# EAGLE design Anouchka (EAGLE 7.1.0)
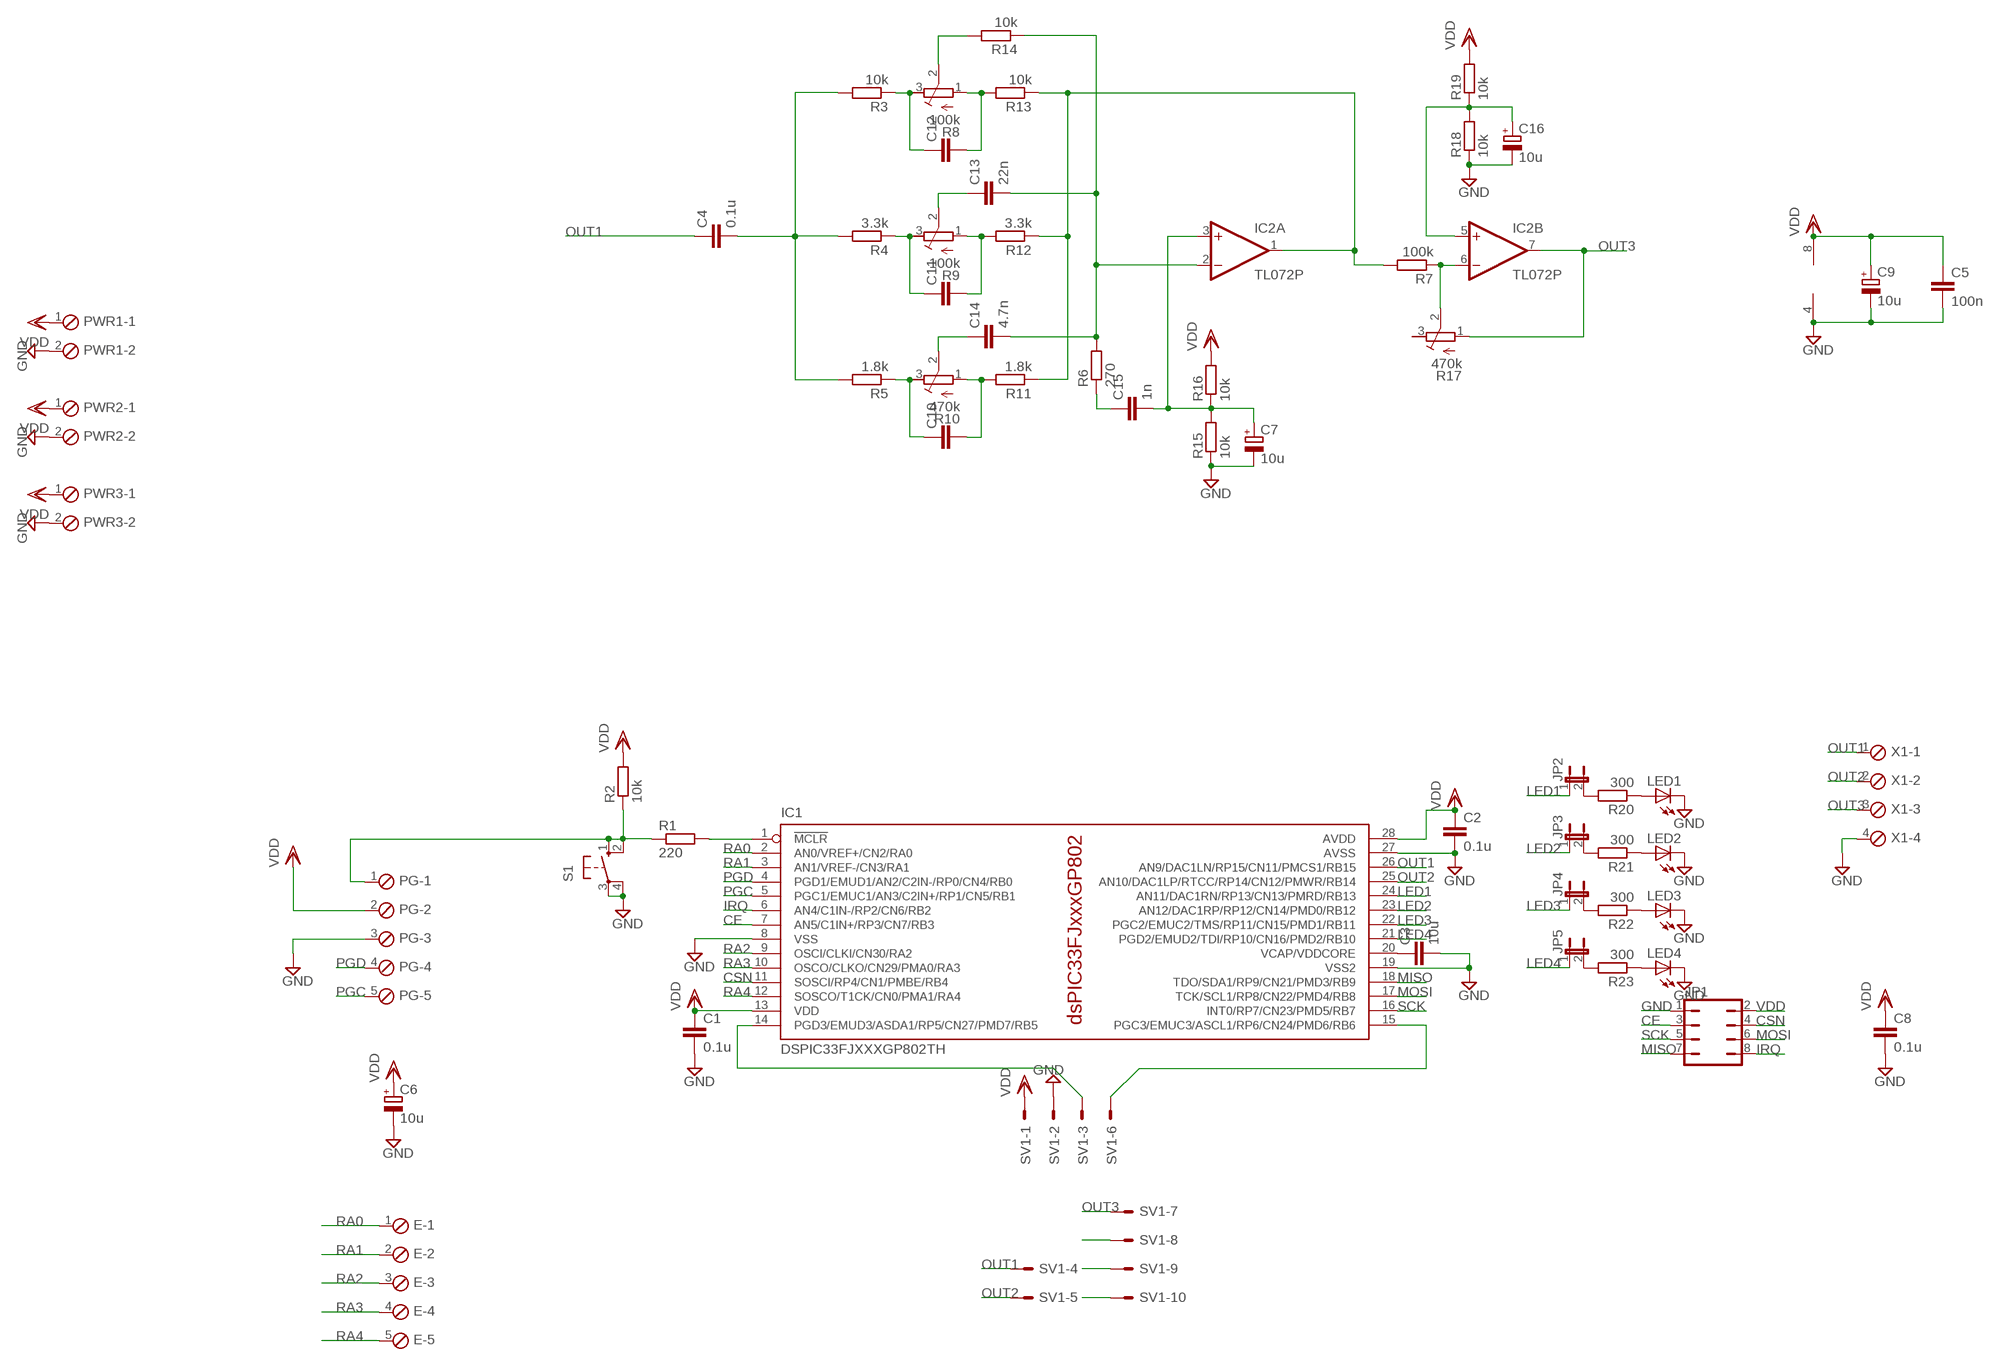
[diagram p0: schematic, sheet 1]

## Parts
C1  0.1u  C-EU025-024X044  [C025-024X044]
C2  0.1u  C-EU025-024X044  [C025-024X044]
C3  10u  C-EU025-024X044  [C025-024X044]
C4  0.1u  C-EU025-024X044  [C025-024X044]
C5  100n  C-EU025-024X044  [C025-024X044]
C6  10u  CPOL-EUE2.5-5  [E2,5-5]
C7  10u  CPOL-EUE2.5-5  [E2,5-5]
C8  0.1u  C-EU025-024X044  [C025-024X044]
C9  10u  CPOL-EUE2.5-5  [E2,5-5]
C10  C-EU025-024X044  [C025-024X044]
C11  C-EU025-024X044  [C025-024X044]
C12  C-EU025-024X044  [C025-024X044]
C13  22n  C-EU025-024X044  [C025-024X044]
C14  4.7n  C-EU025-024X044  [C025-024X044]
C15  1n  C-EU025-024X044  [C025-024X044]
C16  10u  CPOL-EUE2.5-5  [E2,5-5]
E  MPT5  [5POL254]
IC1  DSPIC33FJXXXGP802TH  [DIL28-3]
IC2  TL072P  [DIL08]
JP1  JP4Q  [JP4Q]
JP2  JP1E  [JP1]
JP3  JP1E  [JP1]
JP4  JP1E  [JP1]
JP5  JP1E  [JP1]
LED1  LED3MM  [LED3MM]
LED2  LED3MM  [LED3MM]
LED3  LED3MM  [LED3MM]
LED4  LED3MM  [LED3MM]
PG  MPT5  [5POL254]
PWR1  MPT2  [2POL254]
PWR2  MPT2  [2POL254]
PWR3  MPT2  [2POL254]
R1  220  R-EU_0207/10  [0207/10]
R2  10k  R-EU_0207/10  [0207/10]
R3  10k  R-EU_0207/10  [0207/10]
R4  3.3k  R-EU_0207/10  [0207/10]
R5  1.8k  R-EU_0207/10  [0207/10]
R6  270  R-EU_0207/10  [0207/10]
R7  100k  R-EU_0207/10  [0207/10]
R8  100k  R-TRIMM3339P  [RTRIM3339P]
R9  100k  R-TRIMM3339P  [RTRIM3339P]
R10  470k  R-TRIMM3339P  [RTRIM3339P]
R11  1.8k  R-EU_0207/10  [0207/10]
R12  3.3k  R-EU_0207/10  [0207/10]
R13  10k  R-EU_0207/10  [0207/10]
R14  10k  R-EU_0207/10  [0207/10]
R15  10k  R-EU_0207/10  [0207/10]
R16  10k  R-EU_0207/10  [0207/10]
R17  470k  R-TRIMM3339P  [RTRIM3339P]
R18  10k  R-EU_0207/10  [0207/10]
R19  10k  R-EU_0207/10  [0207/10]
R20  300  R-EU_0207/10  [0207/10]
R21  300  R-EU_0207/10  [0207/10]
R22  300  R-EU_0207/10  [0207/10]
R23  300  R-EU_0207/10  [0207/10]
S1  10-XX  [B3F-10XX]
SV1  ML10E  [ML10]
X1  MPT4  [4POL254]

## Nets
CE: IC1.7(AN5/C1IN+/RP3/CN7/RB3) JP1.3
CSN: IC1.11(SOSCI/RP4/CN1/PMBE/RB4) JP1.4
GND: C1.2 C2.2 C3.2 C5.2 C6.- C7.- C8.2 C9.- C16.- IC1.8(VSS) IC1.19(VSS2) IC1.27(AVSS) IC2.4(P:V-) JP1.1 LED1.K(C) LED2.K(C) LED3.K(C) LED4.K(C) PG.3 PWR1.2 PWR2.2 PWR3.2 R15.1 R18.1 S1.3(P) S1.4(P1) SV1.2 X1.4
IRQ: IC1.6(AN4/C1IN-/RP2/CN6/RB2) JP1.8
LED1: IC1.24(AN11/DAC1RN/RP13/CN13/PMRD/RB13) JP2.1
LED2: IC1.23(AN12/DAC1RP/RP12/CN14/PMD0/RB12) JP3.1
LED3: IC1.22(PGC2/EMUC2/TMS/RP11/CN15/PMD1/RB11) JP4.1
LED4: IC1.21(PGD2/EMUD2/TDI/RP10/CN16/PMD2/RB10) JP5.1
MISO: IC1.18(TDO/SDA1/RP9/CN21/PMD3/RB9) JP1.7
MOSI: IC1.17(TCK/SCL1/RP8/CN22/PMD4/RB8) JP1.6
N$1: IC1.1(!MCLR) R1.2
N$2: PG.1 R1.1 R2.1 S1.1(S) S1.2(S1)
N$3: C3.1 IC1.20(VCAP/VDDCORE)
N$4: IC2.1(A:OUT) R7.2 R11.1 R12.1 R13.1
N$5: C4.2 R3.2 R4.2 R5.2
N$6: C12.1 R3.1 R8.3(E)
N$7: C12.2 R8.1(A) R13.2
N$8: C11.1 R4.1 R9.3(E)
N$9: C11.2 R9.1(A) R12.2
N$10: C10.1 R5.1 R10.3(E)
N$11: C10.2 R10.1(A) R11.2
N$12: C14.1 R10.2(S)
N$13: C13.1 R9.2(S)
N$14: R8.2(S) R14.2
N$15: C13.2 C14.2 IC2.2(A:-IN) R6.2 R14.1
N$16: C15.1 R6.1
N$17: IC2.6(B:-IN) R7.1 R17.2(S)
N$18: C7.+ C15.2 IC2.3(A:+IN) R15.2 R16.1
N$20: C16.+ IC2.5(B:+IN) R18.2 R19.1
N$21: IC1.15(PGC3/EMUC3/ASCL1/RP6/CN24/PMD6/RB6) SV1.6
N$22: IC1.14(PGD3/EMUD3/ASDA1/RP5/CN27/PMD7/RB5) SV1.3
N$23: JP2.2 R20.2
N$26: SV1.8
N$27: SV1.9
N$28: JP3.2 R21.2
N$29: JP4.2 R22.2
N$30: JP5.2 R23.2
N$31: LED1.A R20.1
N$32: LED2.A R21.1
N$33: LED3.A R22.1
N$34: LED4.A R23.1
N$35: SV1.10
OUT1: C4.1 IC1.26(AN9/DAC1LN/RP15/CN11/PMCS1/RB15) SV1.4 X1.1
OUT2: IC1.25(AN10/DAC1LP/RTCC/RP14/CN12/PMWR/RB14) SV1.5 X1.2
OUT3: IC2.7(B:OUT) R17.1(A) SV1.7 X1.3
PGC: IC1.5(PGC1/EMUC1/AN3/C2IN+/RP1/CN5/RB1) PG.5
PGD: IC1.4(PGD1/EMUD1/AN2/C2IN-/RP0/CN4/RB0) PG.4
RA0: E.1 IC1.2(AN0/VREF+/CN2/RA0)
RA1: E.2 IC1.3(AN1/VREF-/CN3/RA1)
RA2: E.3 IC1.9(OSCI/CLKI/CN30/RA2)
RA3: E.4 IC1.10(OSCO/CLKO/CN29/PMA0/RA3)
RA4: E.5 IC1.12(SOSCO/T1CK/CN0/PMA1/RA4)
SCK: IC1.16(INT0/RP7/CN23/PMD5/RB7) JP1.5
VDD: C1.1 C2.1 C5.1 C6.+ C8.1 C9.+ IC1.13(VDD) IC1.28(AVDD) IC2.8(P:V+) JP1.2 PG.2 PWR1.1 PWR2.1 PWR3.1 R2.2 R16.2 R19.2 SV1.1
Unconnected: R17.3(E)

## Library data of the parts
C1-C5 C8 C10-C15 = rcl:C-EU: CAPACITOR, European symbol
C6 C7 C9 C16 = rcl:CPOL-EU: POLARIZED CAPACITOR, European symbol
E PG = con-phoenix-254:MPT5: PHOENIX CONNECTOR; OC_FARNELL: unknown; OC_NEWARK: unknown
IC1 = microchip-dspic33:DSPIC33FJXXXGP802: High-Performance, 16-bit Digital Signal Controllers - dsPIC33FJ64GP802 & dsPIC33FJ128GP802 Source: http://ww1.microchip.com/downloads/en/DeviceDoc/70292B.pdf Operating Range: . Up to 40 MIPS operation (at 3.0-3.6V): - Industrial temperature range (-40°C to +85°C) - Extended temperature range (-40°C to +125°C) High-Performance DSC CPU: . Modified Harvard architecture . C compiler optimized instruction set . 16-bit wide data path . 24-bit wide instructions . Linear program memory addressing up to 4M instruction words . Linear data memory addressing up to 64 Kbytes . 83 base instructions: mostly 1 word/1 cycle . Two 40-bit accumulators with rounding and saturation options . Flexible and powerful addressing modes: - Indirect - Modulo - Bit-Reversed . Software stack . 16 x 16 fractional/integer multiply operations . 32/16 and 16/16 divide operations . Single-cycle multiply and accumulate: - Accumulator write back for DSP operations - Dual data fetch . Up to ±16-bit shifts for up to 40-bit data On-Chip Flash and SRAM: . Flash program memory . Data SRAM . Boot, Secure, and General Security for program Flash Direct Memory Access (DMA): . 8-channel hardware DMA . Up to 2 Kbytes dual ported DMA buffer area (DMA RAM) to store data transferred via DMA: - Allows data transfer between RAM and a peripheral while CPU is executing code (no cycle stealing) . Most peripherals support DMA Timers/Capture/Compare/PWM: . Timer/Counters, up to five 16-bit timers: - Can pair up to make two 32-bit timers - One timer runs as a Real-Time Clock with an external 32.768 kHz oscillator - Programmable prescaler . Input Capture (up to four channels): - Capture on up, down or both edges - 16-bit capture input functions - 4-deep FIFO on each capture . Output Compare (up to four channels): - Single or Dual 16-bit Compare mode - 16-bit Glitchless PWM mode . Hardware Real-Time Clock/Calendar (RTCC): - Provides clock, calendar, and alarm functions Interrupt Controller: . 5-cycle latency . 118 interrupt vectors . Up to 49 available interrupt sources . Up to three external interrupts . Seven programmable priority levels . Five processor exceptions Digital I/O: . Peripheral pin Select functionality . Up to 35 programmable digital I/O pins . Wake-up/Interrupt-on-Change for up to 21 pins . Output pins can drive from 3.0V to 3.6V . Up to 5V output with open drain configuration . All digital input pins are 5V tolerant . 4 mA sink on all I/O pins System Management: . Flexible clock options: - External, crystal, resonator, internal RC - Fully integrated Phase-Locked Loop (PLL) - Extremely low jitter PLL . Power-up Timer . Oscillator Start-up Timer/Stabilizer . Watchdog Timer with its own RC oscillator . Fail-Safe Clock Monitor . Reset by multiple sources Power Management: . On-chip 2.5V voltage regulator . Switch between clock sources in real time . Idle, Sleep, and Doze modes with fast wake-up Analog-to-Digital Converters (ADCs): . 10-bit, 1.1 Msps or 12-bit, 500 Ksps conversion: - Two and four simultaneous samples (10-bit ADC) - Up to 13 input channels with auto-scanning - Conversion start can be manual or synchronized with one of four trigger sources - Conversion possible in Sleep mode - ±2 LSb max integral nonlinearity - ±1 LSb max differential nonlinearity Audio Digital-to-Analog Converter (DAC): . 16-bit Dual Channel DAC module . 100 Ksps maximum sampling rate . Second-Order Digital Delta-Sigma Modulator Data Converter Interface (DCI) module: . Codec interface . Supports I2S and AC.97 protocols . Up to 16-bit data words, up to 16 words per frame . 4-word deep TX and RX buffers Comparator Module: . Two analog comparators with programmable input/output configuration CMOS Flash Technology: . Low-power, high-speed Flash technology . Fully static design . 3.3V (±10%) operating voltage . Industrial and Extended temperature . Low power consumption Communication Modules: . 4-wire SPI (up to two modules): - Framing supports I/O interface to simple codecs - Supports 8-bit and 16-bit data - Supports all serial clock formats and sampling modes . I2C?: - Full Multi-Master Slave mode support - 7-bit and 10-bit addressing - Bus collision detection and arbitration - Integrated signal conditioning - Slave address masking . UART (up to two modules): - Interrupt on address bit detect - Interrupt on UART error - Wake-up on Start bit from Sleep mode - 4-character TX and RX FIFO buffers - LIN bus support - IrDA® encoding and decoding in hardware - High-Speed Baud mode - Hardware Flow Control with CTS and RTS . Enhanced CAN (ECAN. module) 2.0B active: - Up to eight transmit and up to 32 receive buffers - 16 receive filters and three masks - Loopback, Listen Only and Listen All - Messages modes for diagnostics and bus monitoring - Wake-up on CAN message - Automatic processing of Remote Transmission Requests - FIFO mode using DMA - DeviceNet. addressing support . Parallel Master Slave Port (PMP/EPSP): - Supports 8-bit or 16-bit data - Supports 16 address lines . Programmable Cyclic Redundancy Check (CRC): - Programmable bit length for the CRC generator polynomial (up to 16-bit length) - 8-deep, 16-bit or 16-deep, 8-bit FIFO for data input
IC2 = linear:TL072: OP AMP
JP1 = jumper:JP4Q: JUMPER
JP2-JP5 = jumper:JP1E: JUMPER
LED1-LED4 = led:LED: LED OSRAM: - CHIPLED LG R971, LG N971, LY N971, LG Q971, LY Q971, LO R971, LY R971 LH N974, LH R974 LS Q976, LO Q976, LY Q976 LO Q996 - Hyper CHIPLED LW Q18S LB Q993, LB Q99A, LB R99A - SideLED LS A670, LO A670, LY A670, LG A670, LP A670 LB A673, LV A673, LT A673, LW A673 LH A674 LY A675 LS A676, LA A676, LO A676, LY A676, LW A676 LS A679, LY A679, LG A679 - Hyper Micro SIDELED® LS Y876, LA Y876, LO Y876, LY Y876 LT Y87S - SmartLED LW L88C, LW L88S LB L89C, LB L89S, LG L890 LS L89K, LO L89K, LY L89K LS L896, LA L896, LO L896, LY L896 - TOPLED LS T670, LO T670, LY T670, LG T670, LP T670 LSG T670, LSP T670, LSY T670, LOP T670, LYG T670 LG T671, LOG T671, LSG T671 LB T673, LV T673, LT T673, LW T673 LH T674 LS T676, LA T676, LO T676, LY T676, LB T676, LH T676, LSB T676, LW T676 LB T67C, LV T67C, LT T67C, LS T67K, LO T67K, LY T67K, LW E67C LS E67B, LA E67B, LO E67B, LY E67B, LB E67C, LV E67C, LT E67C LW T67C LS T679, LY T679, LG T679 LS T770, LO T770, LY T770, LG T770, LP T770 LB T773, LV T773, LT T773, LW T773 LH T774 LS E675, LA E675, LY E675, LS T675 LS T776, LA T776, LO T776, LY T776, LB T776 LHGB T686 LT T68C, LB T68C - Hyper Mini TOPLED® LB M676 - Mini TOPLED Santana® LG M470 LS M47K, LO M47K, LY M47K Source: http://www.osram.convergy.de LUXEON: - LUMILED® LXK2-PW12-R00, LXK2-PW12-S00, LXK2-PW14-U00, LXK2-PW14-V00 LXK2-PM12-R00, LXK2-PM12-S00, LXK2-PM14-U00 LXK2-PE12-Q00, LXK2-PE12-R00, LXK2-PE12-S00, LXK2-PE14-T00, LXK2-PE14-U00 LXK2-PB12-K00, LXK2-PB12-L00, LXK2-PB12-M00, LXK2-PB14-N00, LXK2-PB14-P00, LXK2-PB14-Q00 LXK2-PR12-L00, LXK2-PR12-M00, LXK2-PR14-Q00, LXK2-PR14-R00 LXK2-PD12-Q00, LXK2-PD12-R00, LXK2-PD12-S00 LXK2-PH12-R00, LXK2-PH12-S00 LXK2-PL12-P00, LXK2-PL12-Q00, LXK2-PL12-R00 Source: www.luxeon.com KINGBRIGHT: KA-3528ASYC Source: www.kingbright.com
PWR1-PWR3 = con-phoenix-254:MPT2: PHOENIX CONNECTOR; OC_FARNELL: unknown; OC_NEWARK: unknown
R1-R7 R11-R16 R18-R23 = rcl:R-EU_: RESISTOR, European symbol
R8-R10 R17 = rcl:R-TRIMM: Trimm resistor
S1 = switch-omron:10-XX: OMRON SWITCH; MPN: B3F-1000; OC_FARNELL: 176432; OC_NEWARK: 36M3542
SV1 = con-ml:ML10E: HARTING; OC_FARNELL: unknown; OC_NEWARK: unknown
X1 = con-phoenix-254:MPT4: PHOENIX CONNECTOR; OC_FARNELL: unknown; OC_NEWARK: unknown

## Board
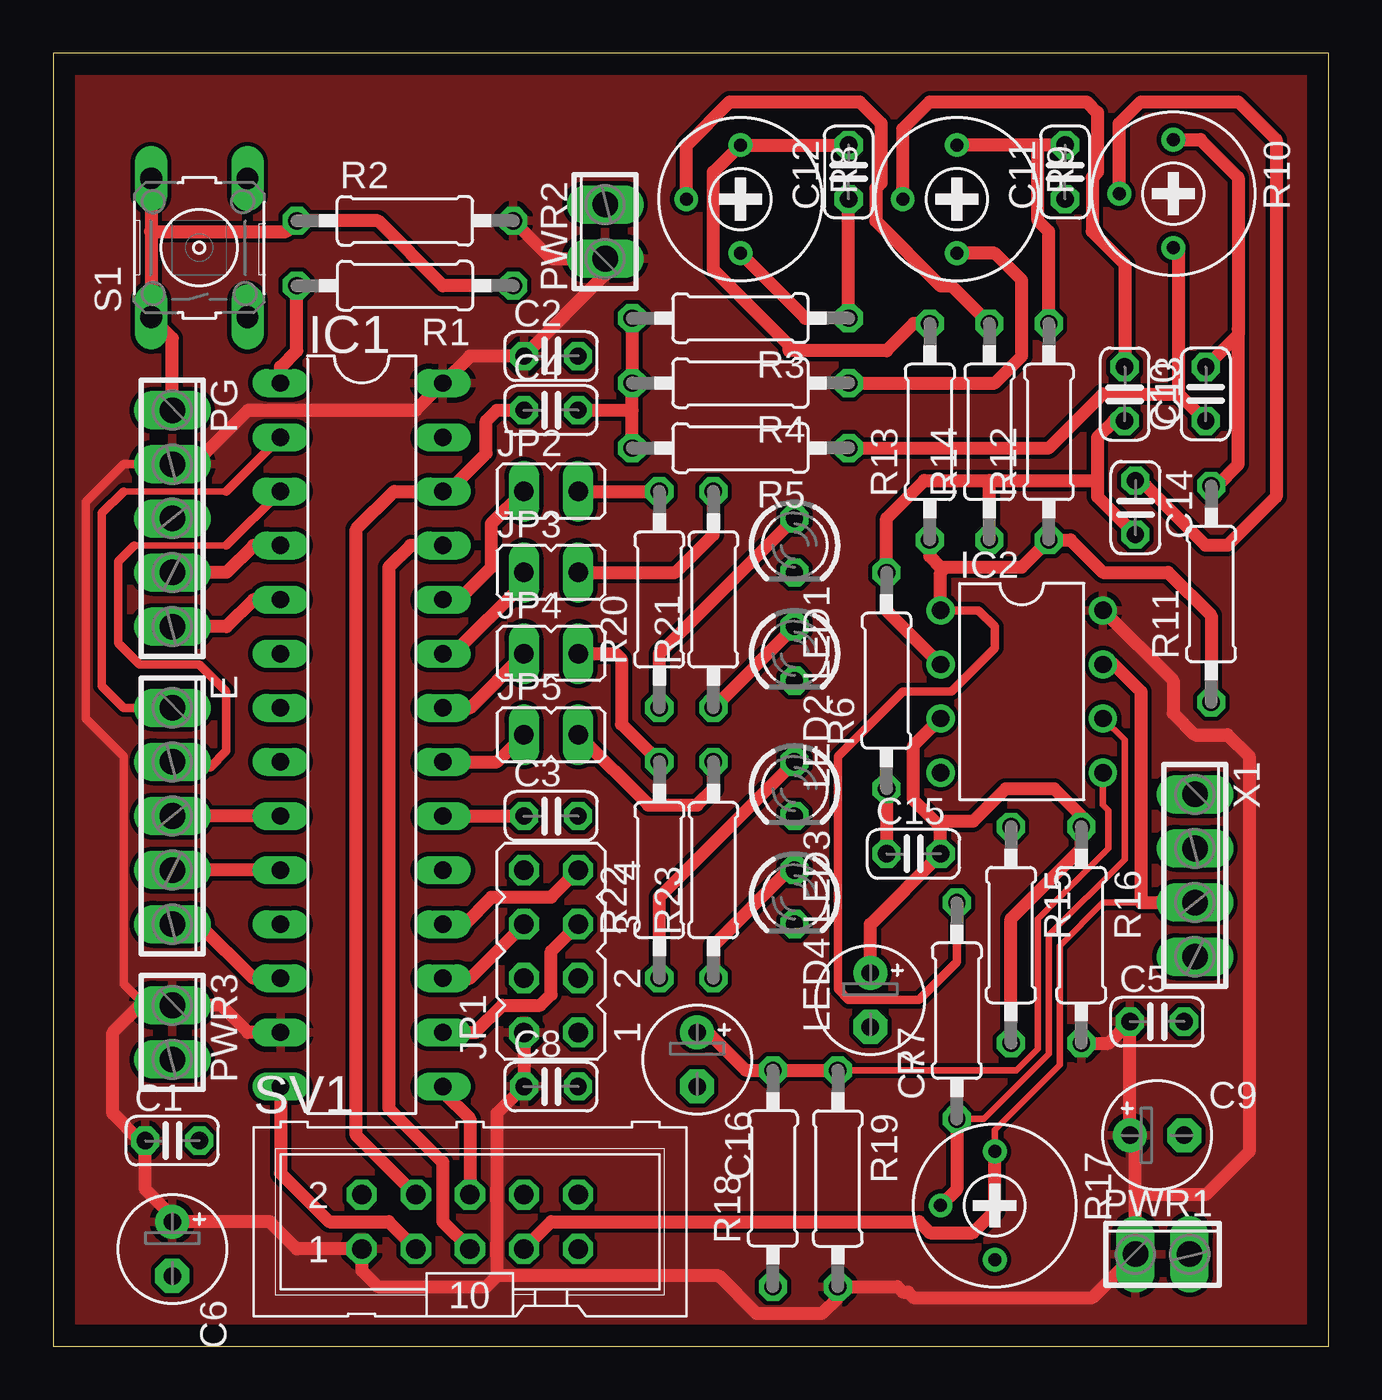
[diagram p1: board, top side]
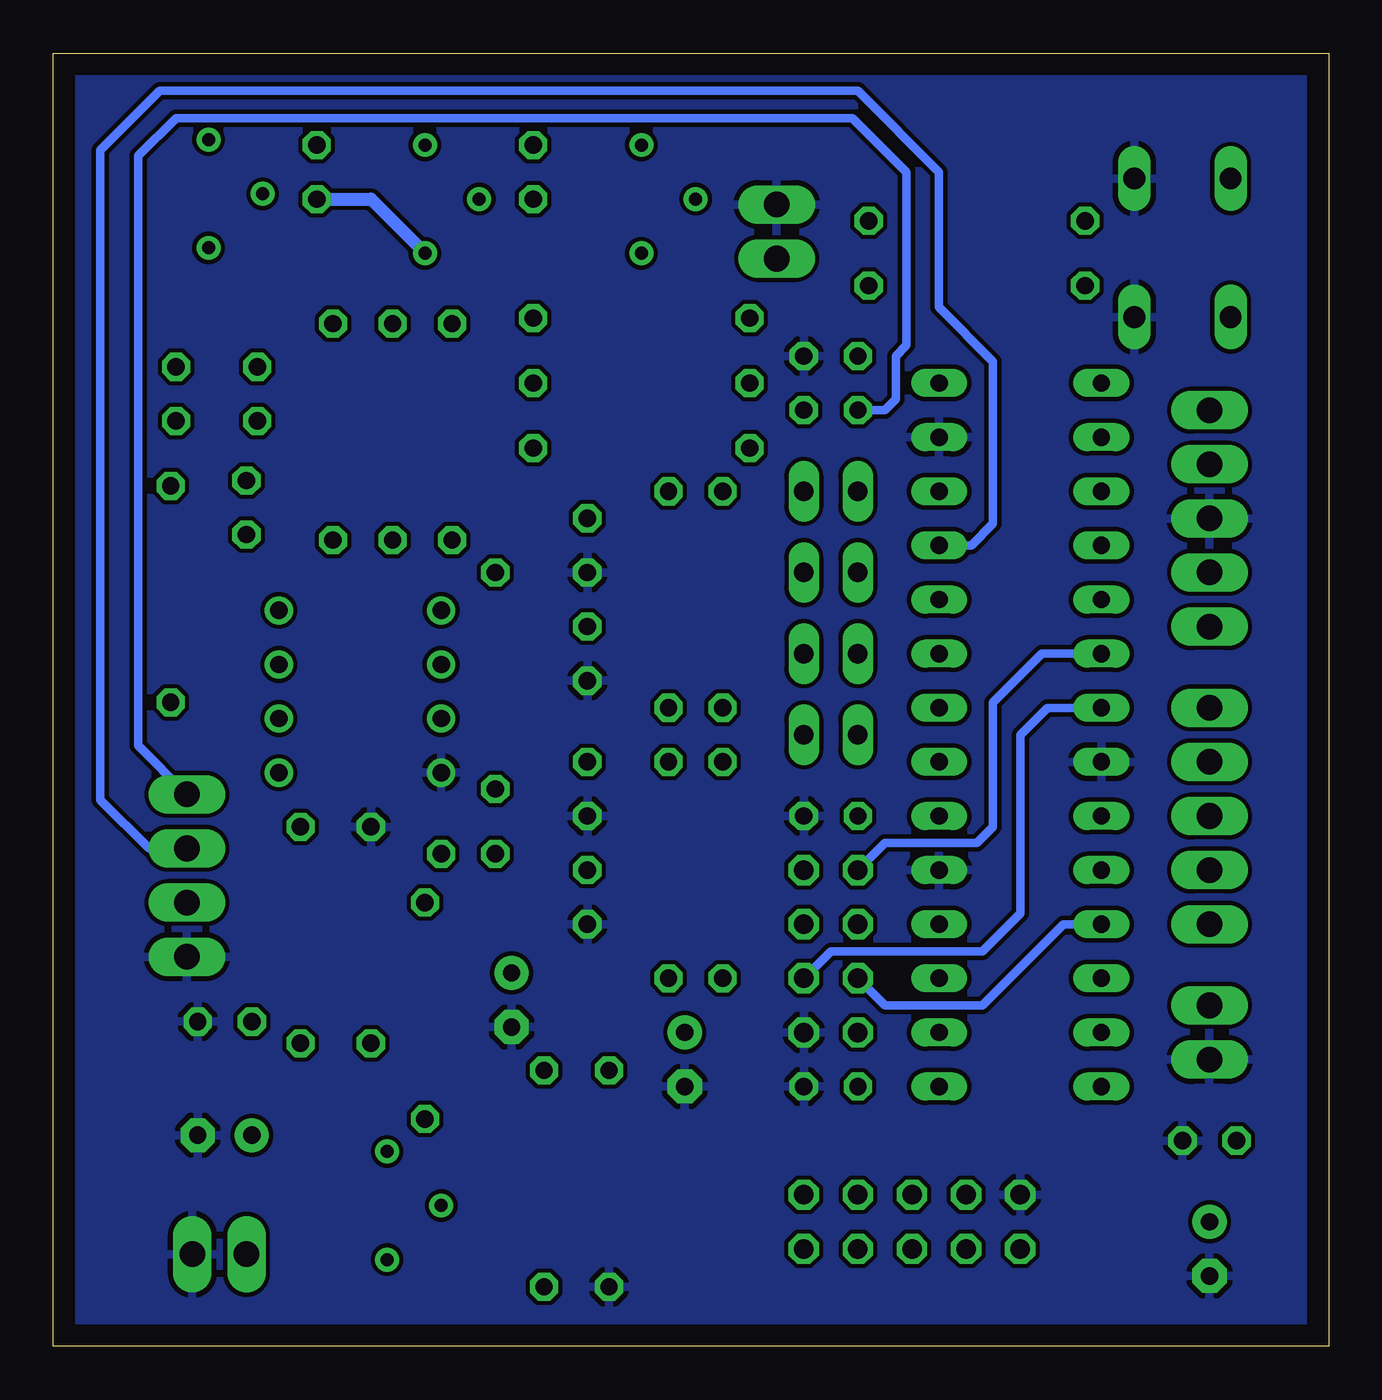
[diagram p2: board, bottom side, seen from below]

Size 59.87 x 60.7 mm. Coordinates in mm from the lower left corner, seen from the top.
Outline: 0,0 59.87,0 59.87,60.7 0,60.7 0,0
Copper layers (1*16): Top 0.035mm / dielectric 1.5mm / Bottom 0.035mm
Design rules "default": minimum track width 10mil, minimum drill 24mil, track to track 8mil, track to pad 8mil, pad to pad 8mil, via to via 8mil, smd to smd 8mil, copper to edge 40mil, drill to drill 8mil, minimum pad ring 10mil, minimum via ring 8mil, stop-mask expansion 4mil, vias tented up to drill 0mil, thermal gap 10mil

### Footprints (pad centres in the part's own frame; a part is rotated, then mirrored left to right if it is on the bottom)
C025-024X044 = drill 0.813 octagon: 1 -1.27,0; 2 1.27,0
E2,5-5 = drill 0.813 pad 1.6: + -1.27,0 | drill 0.813 pad 1.6 octagon: - 1.27,0
5POL254 = drill 1.2 long: 1 -5.08,0; 2 -2.54,0; 3 0,0; 4 2.54,0; 5 5.08,0
DIL28-3 = drill 0.813 long: 1 -16.51,-3.81; 2 -13.97,-3.81; 3 -11.43,-3.81; 4 -8.89,-3.81; 5 -6.35,-3.81; 6 -3.81,-3.81; 7 -1.27,-3.81; 8 1.27,-3.81; 9 3.81,-3.81; 10 6.35,-3.81; 11 8.89,-3.81; 12 11.43,-3.81; 13 13.97,-3.81; 14 16.51,-3.81; 15 16.51,3.81; 16 13.97,3.81; 17 11.43,3.81; 18 8.89,3.81; 19 6.35,3.81; 20 3.81,3.81; 21 1.27,3.81; 22 -1.27,3.81; 23 -3.81,3.81; 24 -6.35,3.81; 25 -8.89,3.81; 26 -11.43,3.81; 27 -13.97,3.81; 28 -16.51,3.81
DIL08 = drill 0.813 pad 1.27: 1 -3.81,-3.81; 2 -1.27,-3.81; 3 1.27,-3.81; 4 3.81,-3.81; 5 3.81,3.81; 6 1.27,3.81; 7 -1.27,3.81; 8 -3.81,3.81
JP4Q = drill 0.914 octagon: 1 -3.81,-1.27; 2 -3.81,1.27; 3 -1.27,-1.27; 4 -1.27,1.27; 5 1.27,-1.27; 6 1.27,1.27; 7 3.81,-1.27; 8 3.81,1.27
JP1 = drill 0.914 long: 1 0,-1.27; 2 0,1.27
LED3MM = drill 0.813 octagon: A -1.27,0; K 1.27,0
2POL254 = drill 1.2 long: 1 -1.27,0; 2 1.27,0
0207/10 = drill 0.813 octagon: 1 -5.08,0; 2 5.08,0
RTRIM3339P = drill 0.61: 1 -2.54,0; 2 0,-2.54; 3 2.54,0
B3F-10XX = drill 1.016 long: 1 -3.251,2.261; 2 3.251,2.261; 3 -3.251,-2.261; 4 3.251,-2.261
ML10 = drill 0.914 octagon: 1 -5.08,-1.27; 2 -5.08,1.27; 3 -2.54,-1.27; 4 -2.54,1.27; 5 0,-1.27; 6 0,1.27; 7 2.54,-1.27; 8 2.54,1.27; 9 5.08,-1.27; 10 5.08,1.27
4POL254 = drill 1.2 long: 1 -3.81,0; 2 -1.27,0; 3 1.27,0; 4 3.81,0

### Placement (x,y rotation side)
C1  5.59,9.65 0 top
C2  23.37,46.48 0 top
C3  23.37,24.89 0 top
C4  23.37,43.94 0 top
C5  51.82,15.24 0 top
C6  5.59,4.57 270 top
C7  38.35,16.26 270 top
C8  23.37,12.19 0 top
C9  51.82,9.91 0 top
C10  54.1,44.7 90 top
C11  47.5,55.12 90 top
C12  37.34,55.12 90 top
C13  50.29,44.7 270 top
C14  50.8,39.37 270 top
C15  40.39,23.11 0 top
C16  30.23,13.46 270 top
E  5.59,24.89 270 top
IC1  14.48,28.7 270 top
IC2  45.47,30.73 270 top
JP1  23.37,18.54 90 top
JP2  23.37,40.13 270 top
JP3  23.37,36.32 270 top
JP4  23.37,32.51 270 top
JP5  23.37,28.7 270 top
LED1  34.8,37.59 270 top
LED2  34.8,32.51 270 top
LED3  34.8,26.16 270 top
LED4  34.8,21.08 270 top
PG  5.59,38.86 270 top
PWR1  52.07,4.32 0 top
PWR2  25.91,52.32 90 top
PWR3  5.59,14.73 270 top
R1  16.51,49.78 180 top
R2  16.51,52.83 0 top
R3  32.26,48.26 180 top
R4  32.26,45.21 180 top
R5  32.26,42.16 180 top
R6  39.12,31.24 90 top
R7  42.42,15.75 90 top
R8  32.26,53.85 270 top
R9  42.42,53.85 270 top
R10  52.58,54.1 270 top
R11  54.36,35.31 90 top
R12  46.74,42.93 90 top
R13  41.15,42.93 90 top
R14  43.94,42.93 90 top
R15  44.96,19.3 270 top
R16  48.26,19.3 270 top
R17  44.2,6.6 270 top
R18  33.78,7.87 90 top
R19  36.83,7.87 270 top
R20  28.45,35.05 90 top
R21  30.99,35.05 90 top
R22  28.45,22.35 90 top
R23  30.99,22.35 90 top
S1  6.86,51.56 90 top
SV1  19.56,5.84 0 top
X1  53.59,22.1 270 top

### Tracks (layer width: path | path; a pad name or v marks a point on that pad's centre or on a via)
CE
  Bottom 0.406: IC1.7 13.21,29.97 14.48,28.7 14.48,20.32 16.26,18.54 23.37,18.54 JP1.3
CSN
  Bottom 0.406: IC1.11 12.45,19.81 16.26,16 20.83,16 JP1.4
GND
  pour Bottom: -5.33,80.52 99.57,80.77 94.23,-2.29 -4.83,-2.29
IRQ
  Bottom 0.406: IC1.6 13.46,32.51 15.75,30.23 15.75,24.38 16.51,23.62 20.83,23.62 JP1.8
LED1
  Top 0.61: IC1.24 19.05,35.05 20.57,36.58 20.57,38.61 JP2.1
LED2
  Top 0.61: IC1.23 18.8,32.51 22.1,35.81 JP3.1
LED3
  Top 0.61: IC1.22 19.56,29.97 JP4.1
LED4
  Top 0.61: IC1.21 20.83,27.43 JP5.1
MISO
  Top 0.61: IC1.18 19.3,19.81 20.57,21.08 23.37,21.08 JP1.7
MOSI
  Top 0.61: IC1.17 19.56,17.27 JP1.6
N$1
  Top 0.61: IC1.1 10.67,45.97 11.43,46.74 R1.2
N$2
  Top 0.61: PG.1 5.59,47.32 S1.1 S1.2 4.6,52.35 4.57,52.32 10.92,52.32 R2.1 15.24,52.83 18.29,49.78 R1.1
N$3
  Top 0.61: IC1.20 C3.1
N$4
  Top 0.406: R7.2 42.42,18.03 40.64,16.26 37.34,16.26 36.83,16.76 36.83,27.69 39.88,30.73 42.16,30.73 44.2,32.77 44.2,33.78 43.43,34.54 IC2.1
  Top 0.61: R13.1 41.15,37.08 41.66,36.58 41.91,36.58 | 41.91,36.58 45.47,36.58 R12.1 47.75,37.85 49.28,36.32 52.32,36.32 54.36,34.29 R11.1 | IC2.1 41.66,36.32 41.91,36.58
N$5
  Top 0.61: C4.2 27.18,43.94 | 27.18,43.94 R4.2 R3.2 | R5.2 27.18,43.94
N$6
  Top 0.61: R8.3 35.31,48.26 R3.1 C12.1
N$7
  Top 0.61: C12.2 R8.1 30.99,55.12 30.99,50.55 34.54,46.99 34.54,46.74 39.12,46.74 40.39,48.01 R13.2
N$8
  Top 0.61: R4.1 44.2,45.21 45.47,46.48 45.47,50.04 44.2,51.31 R9.3
  Bottom 0.61: C11.1 44.96,53.85 R9.3
N$9
  Top 0.61: R12.2 46.74,52.32 46.23,52.83 46.23,56.39 | 46.23,56.39 R9.1 | C11.2 46.23,56.39
N$10
  Top 0.61: R5.1 46.74,42.16 49.28,44.7 52.83,44.7 | C10.1 52.83,44.7 | 52.83,44.7 52.83,51.31 R10.3
N$11
  Top 0.61: R10.1 53.85,56.64 55.63,54.86 55.63,47.75 55.63,47.5 | 55.63,47.5 C10.2 | R11.2 54.61,40.39 55.63,41.4 55.63,47.5
N$12
  Top 0.61: R10.2 50.04,57.4 51.05,58.42 55.63,58.42 57.4,56.64 57.4,39.88 55.12,37.59 54.1,37.59 51.31,40.39 51.05,40.39 C14.1
N$13
  Top 0.61: R9.2 39.88,57.15 41.15,58.42 48.51,58.42 49.02,57.91 49.02,55.12 48.77,54.86 48.77,52.32 50.29,50.8 C13.1
N$14
  Top 0.61: R8.2 29.72,56.39 31.75,58.42 37.85,58.42 38.86,57.4 38.86,54.61 38.61,54.36 38.61,52.83 41.66,49.78 42.16,49.78 R14.2
N$15
  Top 0.61: C13.2 49.78,43.43 49.02,42.67 49.02,40.64 | 49.02,40.64 49.02,39.88 C14.2 | 43.94,40.64 40.89,40.64 39.12,38.86 R6.2 39.12,34.54 IC2.2 | 43.94,40.64 49.02,40.64 | R14.1 43.94,40.64
N$16
  Top 0.61: R6.1 C15.1
N$17
  Top 0.305: R7.1 43.69,10.67 46.74,13.72 46.74,19.3 50.29,22.86 50.29,28.45 IC2.6
  Top 0.61: R7.1 42.42,7.37 R17.2
N$18
  Top 0.61: 41.66,24.38 C15.2 38.35,19.81 C7.+ | 41.66,24.38 40.39,25.65 40.39,28.19 IC2.3 | 41.66,24.38 41.91,24.64 43.18,24.64 44.7,26.16 46.99,26.16 48.26,24.89 R16.1 48.26,23.37 44.96,20.07 R15.2
N$20
  Top 0.305: R19.1 45.21,12.95 46.23,13.97 46.23,20.07 49.53,23.37 49.53,25.15 49.28,25.4 IC2.5
  Top 0.61: C16.+ 30.73,14.73 32.51,12.95 R18.2 R19.1
N$21
  Top 0.61: IC1.15 18.29,11.94 19.56,10.67 SV1.6
N$22
  Top 0.61: IC1.14 10.67,8.13 12.95,5.84 15.75,5.84 SV1.3
N$23
  Top 0.61: JP2.2 R20.2
N$28
  Top 0.61: JP3.2 29.21,36.32 30.99,38.1 R21.2
N$29
  Top 0.61: JP4.2 26.42,32.51 26.67,32.26 26.67,29.21 R22.2
N$30
  Top 0.61: JP5.2 27.94,25.4 30.23,25.4 30.99,26.16 R23.2
N$31
  Top 0.61: R20.1 28.45,32.51 LED1.A
N$32
  Top 0.61: R21.1 LED2.A
N$33
  Top 0.61: R22.1 28.45,21.08 LED3.A
N$34
  Top 0.61: LED4.A 34.54,22.35 30.99,18.8 R23.1
OUT1
  Top 0.61: SV1.4 14.22,9.91 14.22,38.35 16,40.13 IC1.26 18.54,40.13 20.32,41.91 20.32,43.43 20.83,43.94 C4.1
  Bottom 0.406: C4.1 20.83,43.94 20.32,44.45 20.32,46.48 19.81,46.99 19.81,55.12 22.35,57.66 54.1,57.66 55.88,55.88 55.88,28.19 X1.1
OUT2
  Top 0.61: IC1.25 16.76,37.59 15.75,36.58 15.75,11.18 18.29,8.64 18.29,5.84 SV1.5
  Bottom 0.406: IC1.25 16.76,37.59 15.75,38.61 15.75,46.23 18.29,48.77 18.29,55.12 22.1,58.93 54.86,58.93 57.66,56.13 57.66,25.65 55.37,23.37 X1.2
OUT3
  Top 0.305: R17.1 44.2,10.16 47.24,13.21 47.24,18.8 49.28,20.83 51.05,20.83
  Top 0.61: SV1.7 23.37,5.84 40.64,5.84 41.15,5.33 43.18,5.33 44.2,6.35 R17.1 | IC2.7 49.78,32 51.05,30.73 51.05,20.83 X1.3
PGC
  Top 0.61: IC1.5 9.4,35.05 8.13,33.78 PG.5
PGD
  Top 0.61: IC1.4 9.4,37.59 8.13,36.32 PG.4
RA0
  Top 0.305: 8.13,40.13 3.3,40.13
  Top 0.406: IC1.2 8.13,40.13 | 3.3,40.13 2.29,39.12 2.29,30.99 3.3,29.97 E.1
RA1
  Top 0.305: 8.13,37.59 3.81,37.59
  Top 0.406: IC1.3 8.13,37.59 | 3.81,37.59 3.05,36.83 3.05,33.02 4.06,32 6.86,32 8.13,30.73 8.13,27.94 7.37,27.18 5.84,27.18 E.2
RA2
  Top 0.61: IC1.9 E.3
RA3
  Top 0.61: IC1.10 E.4
RA4
  Top 0.61: IC1.12 9.4,17.27 6.86,19.81 E.5
SCK
  Top 0.61: IC1.16 19.81,14.73 21.08,16 22.86,16 23.37,16.51 23.37,18.54 JP1.5
VDD
  Top 0.406: PG.2 3.3,41.4 1.52,39.62 1.52,29.46 3.3,27.69 3.3,17.02 4.19,16.13 4.32,16 PWR3.1
  Top 0.61: IC1.13 9.14,14.73 7.87,16 PWR3.1 | 4.19,16.13 2.79,14.73 2.79,10.92 4.06,9.65 C1.1 4.32,7.37 5.59,6.1 C6.+ 10.16,5.84 11.43,4.57 SV1.1 14.48,3.56 15.24,2.79 20.32,2.79 20.83,3.3 | R2.2 23.37,51.05 PWR2.1 25.91,50.29 C2.1 19.56,46.48 IC1.28 17.02,43.94 9.14,43.94 6.6,41.4 PG.2 | JP1.2 C8.1 20.83,10.92 20.83,3.3 | R16.2 49.53,14.22 C5.1 C9.+ 50.8,9.65 50.8,7.11 | 50.8,7.11 PWR1.1 48.77,2.29 40.39,2.29 40.13,2.54 39.88,2.54 39.62,2.79 R19.2 36.83,2.29 36.07,1.52 33.02,1.52 31.24,3.3 20.83,3.3 | IC2.8 52.58,31.24 52.58,29.72 53.59,28.7 55.12,28.7 56.13,27.69 56.13,9.14 54.1,7.11 50.8,7.11
  pour Top: 0.25,60.45 59.44,60.45 59.44,0.25 0.25,0.25